# Altium schematic sheet AeroBoard V1.SchDoc
size A
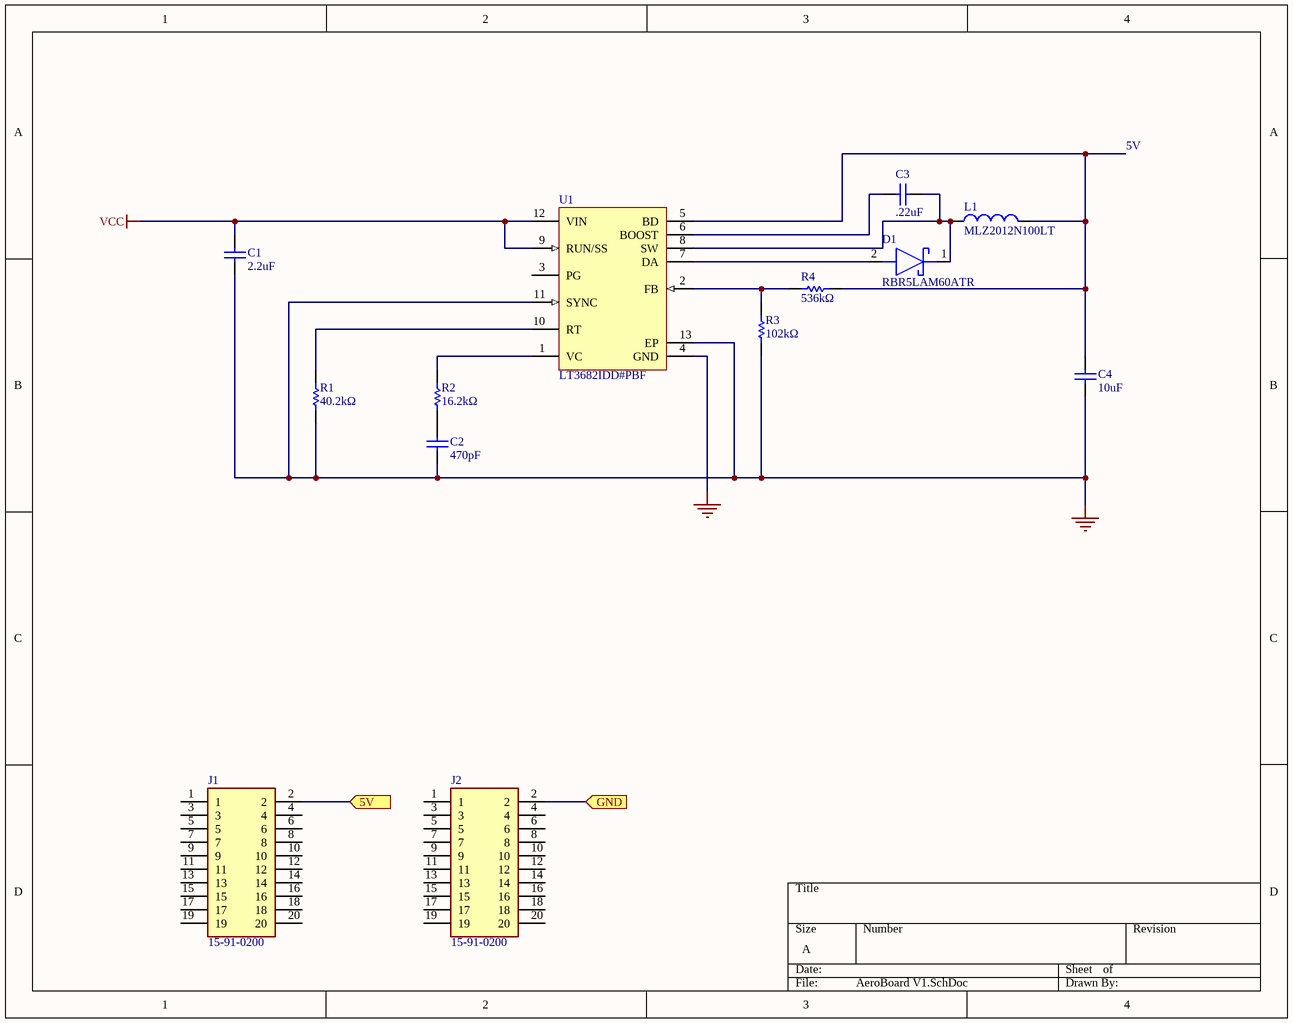
[diagram p0: AeroBoard V1.SchDoc]

## Parts
C1  2.2uF  [CAPC2013X135X50ML10T20]
C2  470pF  [CAPC2013X145X50LL20T25]
C3  .22uF  [CAPC2013X135X45ML10T25]
C4  10uF  [CAPC2013X135X50LL10T20]
D1  RBR5LAM60ATR  [SODFL4725X105N]
J1  15-91-0200  [15910200]
J2  15-91-0200  [15910200]
L1  MLZ2012N100LT  [TDK-IND0805-125_V]
R1  40.2kΩ  [RESC2013X70X40NL20T20]
R2  16.2kΩ  [RESC2013X70X40LL20T20]
R3  102kΩ  [RESC2013X50X30NL20T20]
R4  536kΩ  [RESC2013X50X30NL20T20]
U1  LT3682IDD#PBF  [LT-DD-12_V]

## Ports
5V (in), GND (in)

## Nets
GND: C1.1 C2.1 C4.1 R1.1 R3.1 U1.4(GND) U1.11(SYNC) U1.13(EP)
VCC: C1.2 U1.9(RUN/SS) U1.12(VIN)
5V: J1.2 ; port 5V
GND: J2.2 ; port GND  [a separate net that carries the same name]
NetC2_2: C2.2 R2.1
NetC3_1: C3.1 U1.6(BOOST)
NetC3_2: C3.2 D1.1(K) L1.1 U1.8(SW)
NetC4_2: C4.2 L1.2 R4.1 U1.5(BD)
NetD1_2: D1.2(A) U1.7(DA)
NetR1_2: R1.2 U1.10(RT)
NetR2_2: R2.2 U1.1(VC)
NetR3_2: R3.2 R4.2 U1.2(FB)

Not connected (* = marked no-connect by the designer): J1 1 3 4 5 6 7 8 9 10 11 12 13 14 15 16 17 18 19 20; J2 1 3 4 5 6 7 8 9 10 11 12 13 14 15 16 17 18 19 20; U1 3(PG)

## Notes on the sheet
- 5V

## Library data of the parts
C1 = CMP-2007-03455-1: Manufacturer: Murata; Part Number: GRM21BR71C225KA12L
C2 = CMP-2007-01105-1: Manufacturer: Kemet; Part Number: C0805C471K5RAC7800
C3 = CMP-2007-03524-1: Manufacturer: Murata; Part Number: GRM21BF51E474ZA01L
C4 = CMP-2007-03453-1: Manufacturer: Murata; Part Number: GRM21BR61C106KE15L
D1 = RBR5LAM60ATR: Schottky Diode; Manufacturer_Name: ROHM Semiconductor; Datasheet Link: https://componentsearchengine.com/Datasheets/1/RBR5LAM60ATR.pdf; Height: 1.05mm; Mouser Part Number: 755-RBR5LAM60ATR; Mouser Price/Stock: https://www.mouser.com/Search/Refine.aspx?Keyword=755-RBR5LAM60ATR; Manufacturer_Part_Number: RBR5LAM60ATR
J1 J2 = 15-91-0200: Connector; Manufacturer_Name: Molex; Datasheet Link: https://componentsearchengine.com/Datasheets/1/15-91-0200.pdf; Height: 9.66mm; Mouser Part Number: 538-15-91-0200; Mouser Price/Stock: https://www.mouser.com/Search/Refine.aspx?Keyword=538-15-91-0200; Manufacturer_Part_Number: 15-91-0200
L1 = CMP-0266-00001-1: Multilayer Inductor, 10 uH, ±20%, 300 mOhm, 50MHz, 0805(2012); DC Resistance: 0.3 Ohm; PackageReference: IND0805-125; ComponentLink1URL: http://www.global.tdk.com/; DatasheetVersion: 05/2013; ComponentLink2Description: Datasheet; ComponentLink1Description: Manufacturer URL; Mounting Technology: Suface Mount; ComponentLink2URL: http://www.tdk.co.jp/tcfx01/c533_mlz.pdf; PartNumber: MLZ2012N100LT; PackageDescription: 2-Pin SMT Inductor, 2 x 1.25 mm Body
R1 = CMP-2001-00169-1: Manufacturer: Panasonic; Part Number: ERJ-6ENF4022V
R2 = CMP-2001-04454-1: Part Number: ERJ-6ENF1622V; Manufacturer: Panasonic
R3 = CMP-2001-04904-1: Manufacturer: Vishay Dale; Part Number: CRCW0805102KFKEA
R4 = CMP-2001-04002-1: Manufacturer: Vishay Dale; Part Number: CRCW0805536KFKEA
U1 = CMP-0491-00243-1: 1 A Micropower Step-Down Switching Regulator, 12-pin SON (DD-12), -40 to 125 degC, Pb-Free; Manufacturer: Linear Technology; Over Voltage Protection(V): 60; Frequency Adjust Range: 250kHz - 2.2MHz; Number of Outputs: 1; PackageVersion: Rev. A, 06/2010; ComponentLink2Description: Datasheet; RoHS: TRUE; PackageReference: DD-12; PartNumber: LT3682IDD#PBF; Mounting Technology: Surface Mount; ComponentLink1URL: http://www.linear.com/; ComponentLink3Description: Package Specification; ComponentLink2URL: http://cds.linear.com/docs/en/datasheet/3682f.pdf; PackageDescription: 12-Pin Plastic DFN, Body 3 x 3 mm, Pitch 0.45 mm; ComponentLink3URL: http://cds.linear.com/docs/en/packaging/DFN_12_05-08-1725.pdf; ComponentLink1Description: Manufacturer URL